# EAGLE schematic KellyConnections (EAGLE 7.1.0)
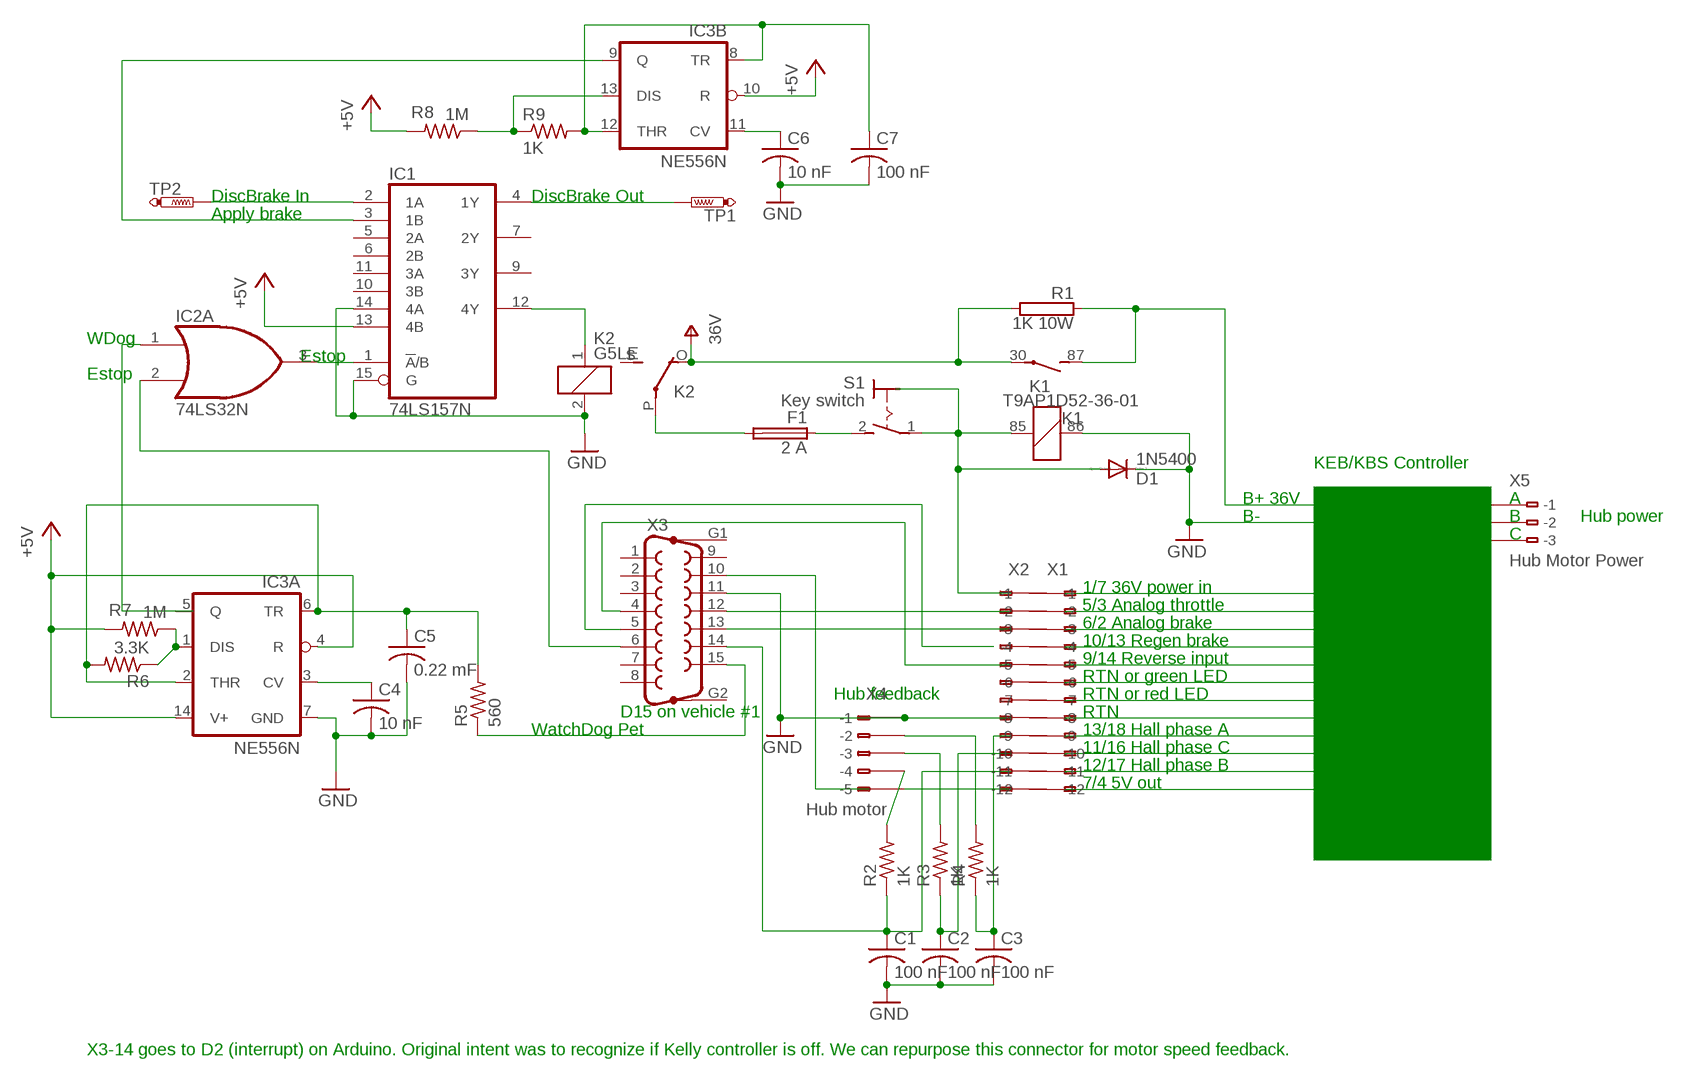
[diagram p0: schematic, sheet 1]

## Parts
C1  100 nF  C-US025-025X050  [C025-025X050]
C2  100 nF  C-US025-025X050  [C025-025X050]
C3  100 nF  C-US025-025X050  [C025-025X050]
C4  10 nF  C-US025-025X050  [C025-025X050]
C5  0.22 mF  C-US025-025X050  [C025-025X050]
C6  10 nF  C-US025-025X050  [C025-025X050]
C7  100 nF  C-US025-025X050  [C025-025X050]
D1  1N5400  [DO201-15]
F1  2 A  TE5  [TE5]
IC1  74LS157N  [DIL16]
IC2  74LS32N  [DIL14]
IC3  NE556N  [DIL14]
K1  T9AP1D52-36-01  CB1A-P-12V  [CB1]
K2  G5LE  [G5LE]
R1  1K 10W  RAC07  [AC07]
R2  1K  R-US_0207/15  [0207/15]
R3  1K  R-US_0207/15  [0207/15]
R4  1K  R-US_0207/15  [0207/15]
R5  560  R-US_0207/15  [0207/15]
R6  3.3K  R-US_0207/15  [0207/15]
R7  1M  R-US_0207/15  [0207/15]
R8  1M  R-US_0207/15  [0207/15]
R9  1K  R-US_0207/15  [0207/15]
S1  Key switch  MS243  [MS243]
TP1  PTR1B1,27  [B1,27]
TP2  PTR1B1,27  [B1,27]
X1  233-112  [233-112]
X2  233-112  [233-112]
X3  F15HP  [F15HP]
X4  Hub motor  233-105  [233-105]
X5  Hub Motor Power  233-103  [233-103]

## Nets
+5V: IC1.13(4B) IC3.4(A:R) IC3.10(B:R) IC3.14(A:V+) R7.2 R8.2
GND: C1.2 C2.2 C3.2 C4.2 C5.2 C6.2 C7.2 D1.C IC1.14(4A) IC1.15(G) IC3.7(A:GND) K1.86 K2.2 X3.11 X4.A1(-1) X4.B1(B-1)
N$13: X1.B1(B-1) X2.A1(-1)
N$14: X1.B2(B-2) X2.A2(-2)
N$15: X1.B3(B-3) X2.A3(-3)
N$16: X1.B4(B-4) X2.A4(-4)
N$17: X1.B5(B-5) X2.A5(-5)
N$18: X1.B6(B-6) X2.A6(-6)
N$19: X1.B7(B-7) X2.A7(-7)
N$20: X1.B8(B-8) X2.A8(-8)
N$21: X1.B9(B-9) X2.A9(-9)
N$22: X1.B10(B-10) X2.A10(-10)
N$23: X1.B11(B-11) X2.A11(-11)
N$24: X1.B12(B-12) X2.A12(-12)
N$25: X1.A12(-12) X2.B12(B-12)
N$26: X1.A1(-1) X2.B1(B-1)
N$27: X1.A2(-2) X2.B2(B-2)
N$28: X1.A3(-3) X2.B3(B-3)
N$29: X1.A4(-4) X2.B4(B-4)
N$30: X1.A5(-5) X2.B5(B-5)
N$31: X1.A6(-6) X2.B6(B-6)
N$32: X1.A7(-7) X2.B7(B-7)
N$33: X1.A8(-8) X2.B8(B-8)
N$34: X1.A9(-9) X2.B9(B-9)
N$35: X1.A10(-10) X2.B10(B-10)
N$36: X1.A11(-11) X2.B11(B-11)
N$37: X3.12
N$38: X3.13
N$39: R2.2 X4.B4(B-4)
N$40: R4.2 X4.B2(B-2)
N$41: X3.5
N$42: X3.4
N$43: D1.A K1.85 S1.1(P)
N$44: F1.1 S1.2(S)
N$45: C1.1 R2.1 X3.14
N$46: R3.2 X4.B3(B-3)
N$47: K1.87(2:S) R1.1
N$48: X4.B5(B-5)
N$49: F1.2 K2.P(2:P)
N$50: C2.1 R3.1
N$51: C3.1 R4.1
N$52: X3.10
N$53: IC1.12(4Y) K2.1
N$54: IC2.1(A:I0)
N$55: IC1.1(!A!/B) IC2.3(A:O)
N$56: C4.1 IC3.3(A:CV)
N$57: IC2.2(A:I1) X3.6
N$58: R5.1 X3.15
N$59: C5.1 IC3.2(A:THR) IC3.6(A:TR) R5.2 R6.2
N$60: IC1.2(1A) TP2.TP
N$61: IC1.3(1B) IC3.9(B:Q)
N$62: IC3.1(A:DIS) R6.1 R7.1
N$64: IC3.13(B:DIS) R8.1 R9.1
N$66: C7.1 IC3.8(B:TR) IC3.12(B:THR) R9.2
N$67: C6.1 IC3.11(B:CV)
N$68: IC1.4(1Y) TP1.TP
V+: K1.30(2:P) K2.O(2:O) R1.2 ; supply symbol labelled 36V
Unconnected: IC1.5(2A) IC1.6(2B) IC1.7(2Y) IC1.9(3Y) IC1.10(3B) IC1.11(3A) IC2.4(B:I0) IC2.5(B:I1) IC2.6(B:O) IC2.8(C:O) IC2.9(C:I0) IC2.10(C:I1) IC2.11(D:O) IC2.12(D:I0) IC2.13(D:I1) IC3.5(A:Q) K2.S(2:S) X3.1 X3.2 X3.3 X3.7 X3.8 X3.9 X3.G1 X3.G2 X4.A2(-2) X4.A3(-3) X4.A4(-4) X4.A5(-5) X5.A1(-1) X5.A2(-2) X5.A3(-3) X5.B1(B-1) X5.B2(B-2) X5.B3(B-3)

## Notes on the sheet
- DiscBrake In | DiscBrake Out
- Apply brake
- WDog
- Estop
- Estop
- KEB/KBS Controller
- B+ 36V | A
- B- | B | Hub power
- C
- 1/7 36V power in
- 5/3 Analog throttle
- 6/2 Analog brake
- 10/13 Regen brake
- 9/14 Reverse input
- RTN or green LED
- Hub feedback | RTN or red LED
- D15 on vehicle #1 | RTN
- WatchDog Pet | 13/18 Hall phase A
- 11/16 Hall phase C
- 12/17 Hall phase B
- 7/4 5V out
- X3-14 goes to D2 (interrupt) on Arduino. Original intent was to recognize if Kelly controller is off. We can repurpose this connector for motor speed feedback.

## Power pins joined to a net without a drawn wire
GND: IC1.8(GND) IC2.7(P:GND)
VCC: IC1.16(VCC) IC2.14(P:VCC)

## Library data of the parts
C1-C7 = rcl:C-US: CAPACITOR, American symbol
D1 = diode:1N5400: DIODE standard rectifier, 3 A, 50 V (Motorola)
F1 = fuse:TE5: FUSE Wickmann; OC_FARNELL: unknown; OC_NEWARK: unknown
IC1 = 74xx-us:74*157: Quadruple 2-line to 1-line data SELECTOR/MULTIPLEXER
IC2 = 74xx-us:74*32: Quad 2-input OR gate
IC3 = linear:*556: Dual TIMER
K1 = relay:CB*: HIGH POWER AUTOMOTIVE RELAY Form A NAiS Source: http://www.mew-europe.com/.. en_ds_61202_0000.pdf; MF: AROMAT/ MATSUSHITA; MPN: CB1A-P-12V; OC_FARNELL: 1270582; OC_NEWARK: 50B849
K2 = relay:G5LE: RELAY 1 x switch, 10 A/120 V AC, 8 A/30 V DC, Omron; OC_FARNELL: unknown; OC_NEWARK: unknown
R1 = resistor-power:R: Power Resitor; OC_FARNELL: unknown; OC_NEWARK: unknown
R2-R9 = rcl:R-US_: RESISTOR, American symbol
S1 = switch:MS243: TOGGLE SWITCH
TP1 TP2 = testpad:PTR1: TEST PIN
X1 X2 = con-wago255:233-112: WAGO; MPN: 233-112; OC_FARNELL: unknown; OC_NEWARK: 28K9053
X3 = con-subd:F15HP: SUB-D; OC_FARNELL: unknown; OC_NEWARK: unknown
X4 = con-wago:233-105: WAGO Cage Clamp; MPN: 233-105; OC_FARNELL: unknown; OC_NEWARK: 28K9047
X5 = con-wago:233-103: WAGO Cage Clamp; MPN: 233-103; OC_FARNELL: unknown; OC_NEWARK: 28K9045